# Altium project Terra.PrjPcb (part 3 of 3)

## Sheet Power.SchDoc
size A3; Author: Швецов С.В.; Organization: PapuaSoft; SheetNumber: 6; SheetTotal: 8
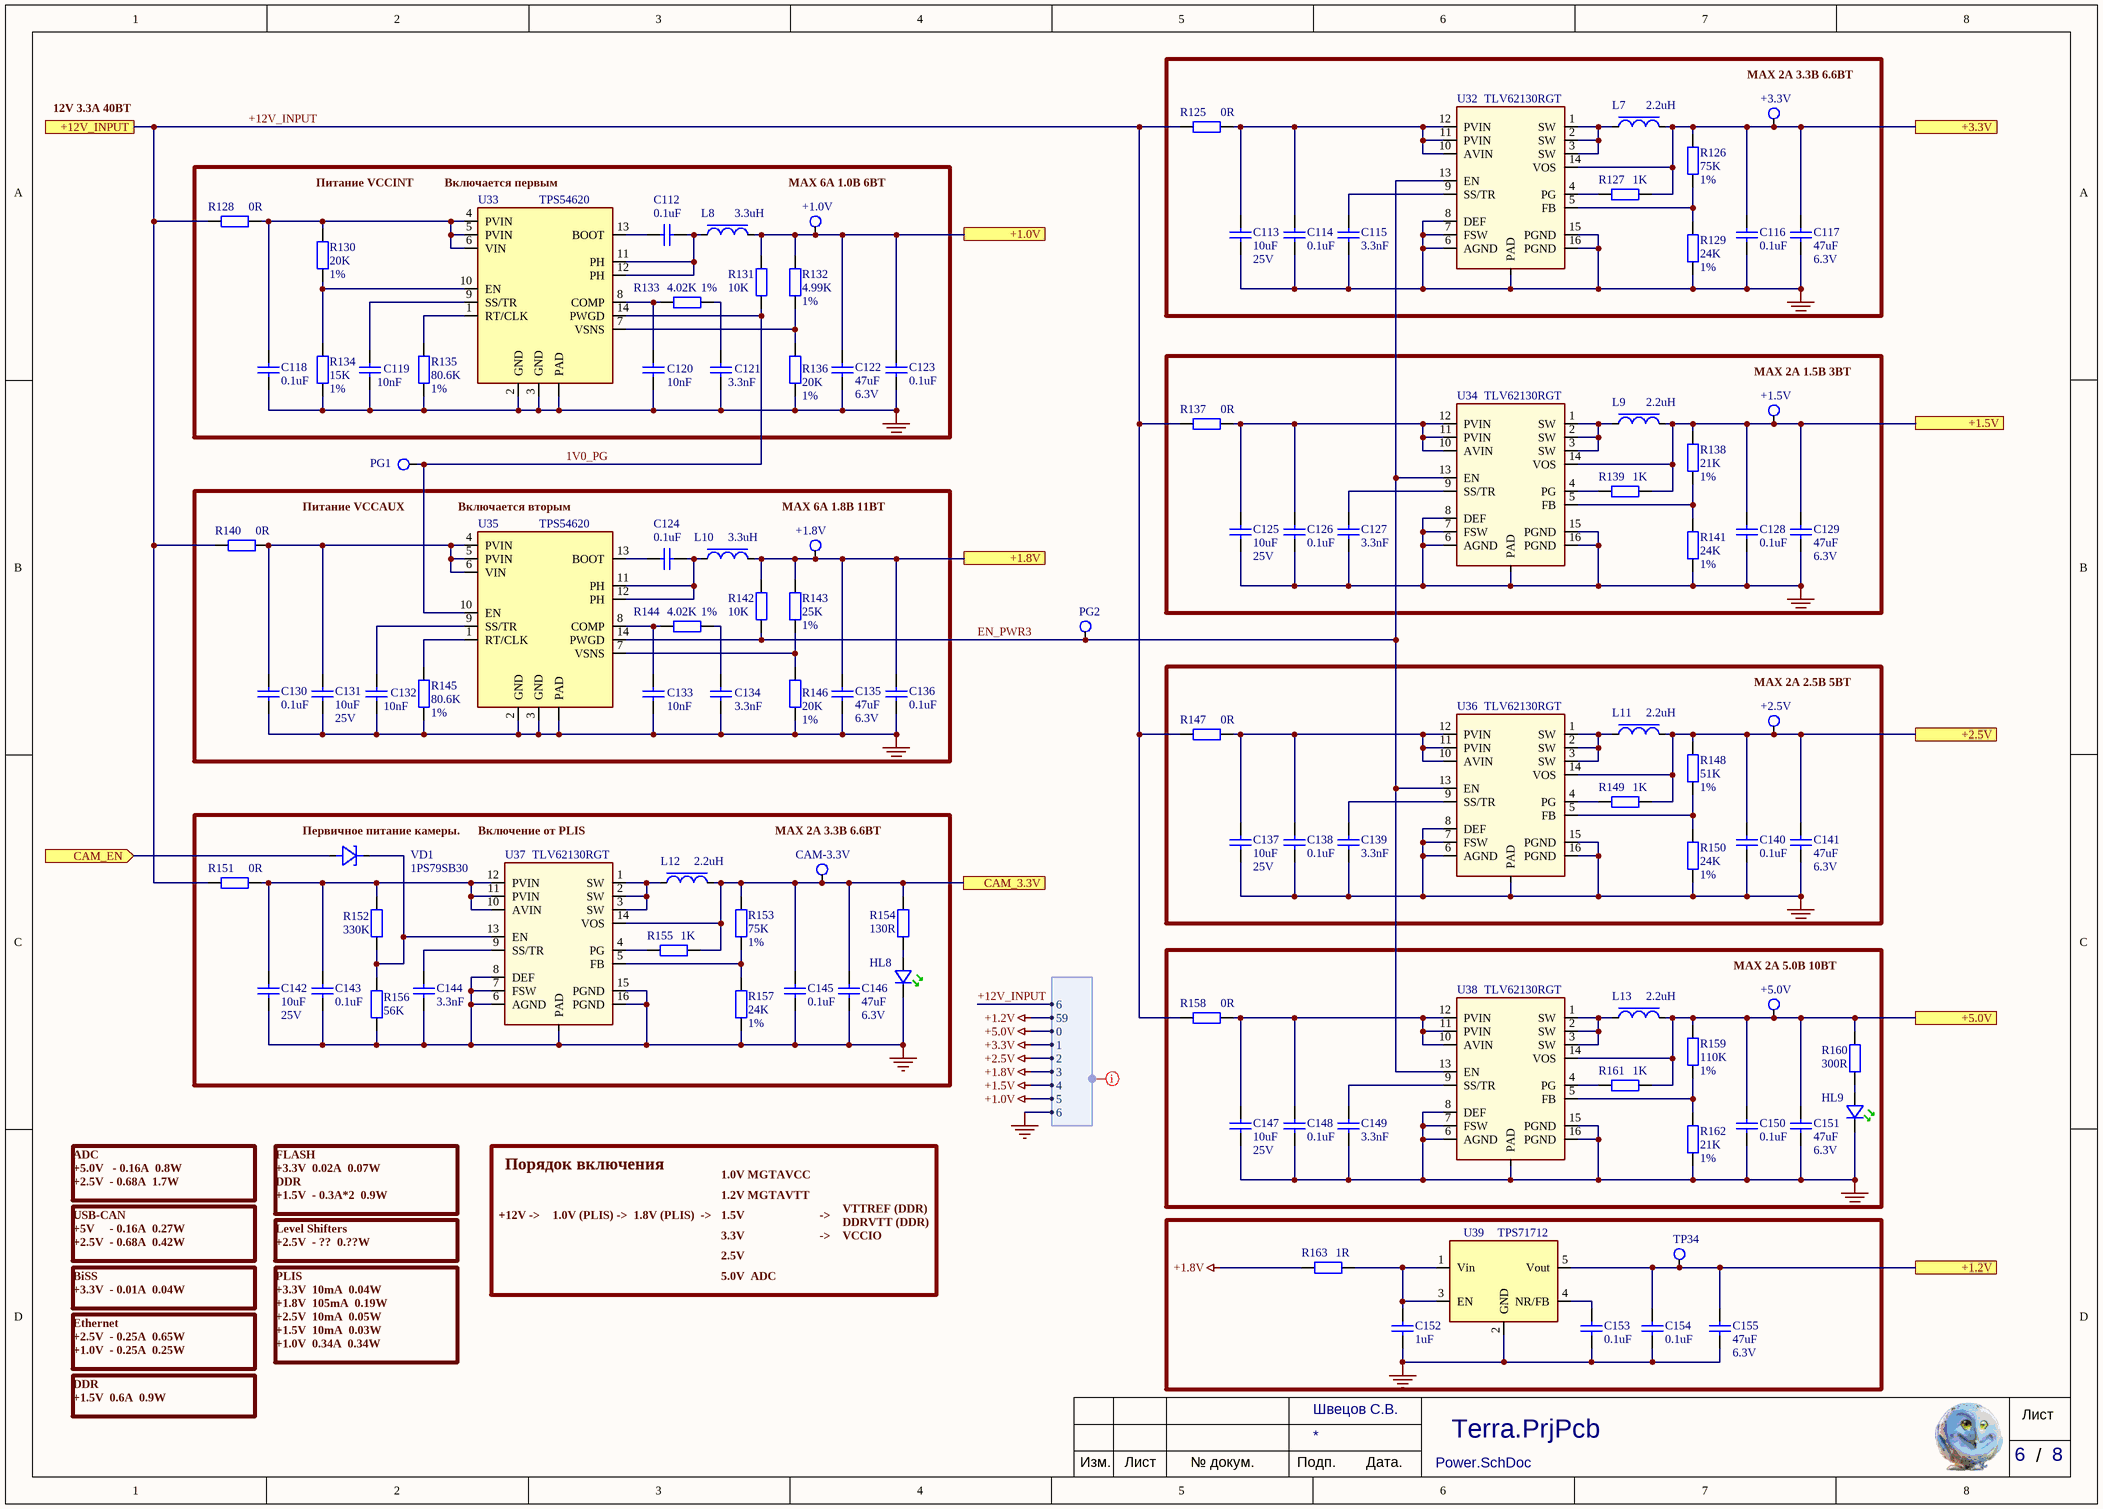
[diagram p8: Power.SchDoc]

### Parts
C112  value 0.1uF  [C0402]  (hidden comment: Cap)
C113  value 10uF  Voltage: 25V  [C0805]  (hidden comment: Cap)
C114  value 0.1uF  [C0402]  (hidden comment: Cap)
C115  value 3.3nF  [C0402]  (hidden comment: Cap)
C116  value 0.1uF  [C0402]  (hidden comment: Cap)
C117  value 47uF  Voltage: 6.3V  [C0805]  (hidden comment: Cap)
C118  value 0.1uF  [C0402]  (hidden comment: Cap)
C119  value 10nF  [C0402]  (hidden comment: Cap)
C120  value 10nF  [C0402]  (hidden comment: Cap)
C121  value 3.3nF  [C0402]  (hidden comment: Cap)
C122  value 47uF  Voltage: 6.3V  [C0805]  (hidden comment: Cap)
C123  value 0.1uF  [C0402]  (hidden comment: Cap)
C124  value 0.1uF  [C0402]  (hidden comment: Cap)
C125  value 10uF  Voltage: 25V  [C0805]  (hidden comment: Cap)
C126  value 0.1uF  [C0402]  (hidden comment: Cap)
C127  value 3.3nF  [C0402]  (hidden comment: Cap)
C128  value 0.1uF  [C0402]  (hidden comment: Cap)
C129  value 47uF  Voltage: 6.3V  [C0805]  (hidden comment: Cap)
C130  value 0.1uF  [C0402]  (hidden comment: Cap)
C131  value 10uF  Voltage: 25V  [C0805]  (hidden comment: Cap)
C132  value 10nF  [C0402]  (hidden comment: Cap)
C133  value 10nF  [C0402]  (hidden comment: Cap)
C134  value 3.3nF  [C0402]  (hidden comment: Cap)
C135  value 47uF  Voltage: 6.3V  [C0805]  (hidden comment: Cap)
C136  value 0.1uF  [C0402]  (hidden comment: Cap)
C137  value 10uF  Voltage: 25V  [C0805]  (hidden comment: Cap)
C138  value 0.1uF  [C0402]  (hidden comment: Cap)
C139  value 3.3nF  [C0402]  (hidden comment: Cap)
C140  value 0.1uF  [C0402]  (hidden comment: Cap)
C141  value 47uF  Voltage: 6.3V  [C0805]  (hidden comment: Cap)
C142  value 10uF  Voltage: 25V  [C0805]  (hidden comment: Cap)
C143  value 0.1uF  [C0402]  (hidden comment: Cap)
C144  value 3.3nF  [C0402]  (hidden comment: Cap)
C145  value 0.1uF  [C0402]  (hidden comment: Cap)
C146  value 47uF  Voltage: 6.3V  [C0805]  (hidden comment: Cap)
C147  value 10uF  Voltage: 25V  [C0805]  (hidden comment: Cap)
C148  value 0.1uF  [C0402]  (hidden comment: Cap)
C149  value 3.3nF  [C0402]  (hidden comment: Cap)
C150  value 0.1uF  [C0402]  (hidden comment: Cap)
C151  value 47uF  Voltage: 6.3V  [C0805]  (hidden comment: Cap)
C152  value 1uF  [C0603]  (hidden comment: Cap)
C153  value 0.1uF  [C0402]  (hidden comment: Cap)
C154  value 0.1uF  [C0402]  (hidden comment: Cap)
C155  value 47uF  Voltage: 6.3V  [C0805]  (hidden comment: Cap)
HL8  (no value)  [KP-1608_16x08x11_L]
HL9  (no value)  [KP-1608_16x08x11_L]
L7  2.2uH  [B82472G6222M000]
L8  3.3uH  [INDPM101101X680N]
L9  2.2uH  [B82472G6222M000]
L10  3.3uH  [INDPM101101X680N]
L11  2.2uH  [B82472G6222M000]
L12  2.2uH  [B82472G6222M000]
L13  2.2uH  [B82472G6222M000]
R125  value 0R  [R0402]  (hidden comment: Res2)
R126  value 75K  Precision: 1%  [R0402]  (hidden comment: Res2)
R127  value 1K  [R0402]  (hidden comment: Res2)
R128  value 0R  [R0402]  (hidden comment: Res2)
R129  value 24K  Precision: 1%  [R0402]  (hidden comment: Res2)
R130  value 20K  Precision: 1%  [R0402]  (hidden comment: Res2)
R131  value 10K  [R0402]  (hidden comment: Res2)
R132  value 4.99K  Precision: 1%  [R0402]  (hidden comment: Res2)
R133  value 4.02K  Precision: 1%  [R0402]  (hidden comment: Res2)
R134  value 15K  Precision: 1%  [R0402]  (hidden comment: Res2)
R135  value 80.6K  Precision: 1%  [R0402]  (hidden comment: Res2)
R136  value 20K  Precision: 1%  [R0402]  (hidden comment: Res2)
R137  value 0R  [R0402]  (hidden comment: Res2)
R138  value 21K  Precision: 1%  [R0402]  (hidden comment: Res2)
R139  value 1K  [R0402]  (hidden comment: Res2)
R140  value 0R  [R0402]  (hidden comment: Res2)
R141  value 24K  Precision: 1%  [R0402]  (hidden comment: Res2)
R142  value 10K  [R0402]  (hidden comment: Res2)
R143  value 25K  Precision: 1%  [R0402]  (hidden comment: Res2)
R144  value 4.02K  Precision: 1%  [R0402]  (hidden comment: Res2)
R145  value 80.6K  Precision: 1%  [R0402]  (hidden comment: Res2)
R146  value 20K  Precision: 1%  [R0402]  (hidden comment: Res2)
R147  value 0R  [R0402]  (hidden comment: Res2)
R148  value 51K  Precision: 1%  [R0402]  (hidden comment: Res2)
R149  value 1K  [R0402]  (hidden comment: Res2)
R150  value 24K  Precision: 1%  [R0402]  (hidden comment: Res2)
R151  value 0R  [R0402]  (hidden comment: Res2)
R152  value 330K  [R0402]  (hidden comment: Res2)
R153  value 75K  Precision: 1%  [R0402]  (hidden comment: Res2)
R154  value 130R  [R0402]  (hidden comment: Res2)
R155  value 1K  [R0402]  (hidden comment: Res2)
R156  value 56K  [R0402]  (hidden comment: Res2)
R157  value 24K  Precision: 1%  [R0402]  (hidden comment: Res2)
R158  value 0R  [R0402]  (hidden comment: Res2)
R159  value 110K  Precision: 1%  [R0402]  (hidden comment: Res2)
R160  value 300R  [R0402]  (hidden comment: Res2)
R161  value 1K  [R0402]  (hidden comment: Res2)
R162  value 21K  Precision: 1%  [R0402]  (hidden comment: Res2)
R163  value 1R  [R0402]  (hidden comment: Res2)
TP25  MarkPCB: +3.3V  [TP_0MM5_1MM0]  (no BOM)
TP26  MarkPCB: +1.0V  [TP_0MM5_1MM0]  (no BOM)
TP27  MarkPCB: +1.5V  [TP_0MM5_1MM0]  (no BOM)
TP28  MarkPCB: PG1  [TP_0MM5_1MM0]  (no BOM)
TP29  MarkPCB: +1.8V  [TP_0MM5_1MM0]  (no BOM)
TP30  MarkPCB: PG2  [TP_0MM5_1MM0]  (no BOM)
TP31  MarkPCB: +2.5V  [TP_0MM5_1MM0]  (no BOM)
TP32  MarkPCB: CAM-3.3V  [TP_0MM5_1MM0]  (no BOM)
TP33  MarkPCB: +5.0V  [TP_0MM5_1MM0]  (no BOM)
TP34  (no value)  [TP_0MM5_1MM0]  (no BOM)
U32  TLV62130RGT  [QFN50P300X300X100-17N-D]
U33  value TPS54620  [RGY-(S-PVQFN-N14)]  (hidden comment: TPS60500)
U34  TLV62130RGT  [QFN50P300X300X100-17N-D]
U35  value TPS54620  [RGY-(S-PVQFN-N14)]  (hidden comment: TPS60500)
U36  TLV62130RGT  [QFN50P300X300X100-17N-D]
U37  TLV62130RGT  [QFN50P300X300X100-17N-D]
U38  TLV62130RGT  [QFN50P300X300X100-17N-D]
U39  value TPS71712  [SOT23_5]
VD1  1PS79SB30  [sod523]

### Ports
+1.0V, +1.2V, +1.5V, +1.8V, +2.5V, +3.3V, +5.0V, +12V_INPUT, CAM_3.3V, CAM_EN (in)

### Harnesses
POWER: 0, 1, 2, 3, 4, 5, 6, 59, 6

### Nets
+1.0V: C122.1 C123.1 L8.1 R131.2 R132.2 TP26.1(e1) ; port +1.0V, harness POWER.5
+1.2V: C154.1 C155.1 TP34.1(e1) U39.5(Vout) ; port +1.2V, harness POWER.59
+1.5V: C128.1 C129.1 L9.1 R138.1 R139.1 TP27.1(e1) U34.14(VOS) ; port +1.5V, harness POWER.4
+1.8V: C135.1 C136.1 L10.1 R142.2 R143.2 R163.2 TP29.1(e1) ; port +1.8V, harness POWER.3
+2.5V: C140.1 C141.1 L11.1 R148.1 R149.1 TP31.1(e1) U36.14(VOS) ; port +2.5V, harness POWER.2
+3.3V: C116.1 C117.1 L7.1 R126.1 R127.1 TP25.1(e1) U32.14(VOS) ; port +3.3V, harness POWER.1
+5.0V: C150.1 C151.1 L13.1 R159.1 R160.2 R161.1 TP33.1(e1) U38.14(VOS) ; port +5.0V, harness POWER.0
+12V_INPUT: C113.2 C114.2 C115.2 C116.2 C117.2 C118.2 C119.1 C120.1 C121.1 C122.2 C123.2 C125.2 C126.2 C127.2 C128.2 C129.2 C130.2 C131.2 C132.1 C133.1 C134.1 C135.2 C136.2 C137.2 C138.2 C139.2 C140.2 C141.2 C142.2 C143.2 C144.2 C145.2 C146.2 C147.2 C148.2 C149.2 C150.2 C151.2 C152.2 C153.2 C154.2 C155.2 HL8.2(Cathode) HL9.2(Cathode) R125.2 R128.2 R129.1 R134.2 R135.1 R136.1 R137.2 R140.2 R141.1 R145.1 R146.1 R147.2 R150.1 R151.2 R156.1 R157.1 R158.2 R162.1 U32.0(PAD) U32.6(AGND) U32.7(FSW) U32.8(DEF) U32.15(PGND) U32.16(PGND) U33.0(PAD) U33.2(GND) U33.3(GND) U34.0(PAD) U34.6(AGND) U34.7(FSW) U34.8(DEF) U34.15(PGND) U34.16(PGND) U35.0(PAD) U35.2(GND) U35.3(GND) U36.0(PAD) U36.6(AGND) U36.7(FSW) U36.8(DEF) U36.15(PGND) U36.16(PGND) U37.0(PAD) U37.6(AGND) U37.7(FSW) U37.8(DEF) U37.15(PGND) U37.16(PGND) U38.0(PAD) U38.6(AGND) U38.7(FSW) U38.8(DEF) U38.15(PGND) U38.16(PGND) U39.2(GND) ; port +12V_INPUT, harness POWER.6  [also labelled GND]
1V0_PG: R131.1 TP28.1(e1) U33.14(PWGD) U35.10(EN)
CAM_EN: VD1.2 ; port CAM_EN
EN_PWR3: R142.1 TP30.1(e1) U32.13(EN) U34.13(EN) U35.14(PWGD) U36.13(EN) U38.13(EN)
NetC61_1: C145.1 C146.1 L12.1 R153.1 R154.2 R155.1 TP32.1(e1) U37.14(VOS) ; port CAM_3.3V
NetC112_1: C112.1 U33.13(BOOT)
NetC112_2: C112.2 L8.2 U33.11(PH) U33.12(PH)
NetC113_1: C113.1 C114.1 R125.1 U32.10(AVIN) U32.11(PVIN) U32.12(PVIN)
NetC115_1: C115.1 U32.9(SS/TR)
NetC118_1: C118.1 R128.1 R130.1 U33.4(PVIN) U33.5(PVIN) U33.6(VIN)
NetC119_2: C119.2 U33.9(SS/TR)
NetC120_2: C120.2 R133.1 U33.8(COMP)
NetC121_2: C121.2 R133.2
NetC124_1: C124.1 U35.13(BOOT)
NetC124_2: C124.2 L10.2 U35.11(PH) U35.12(PH)
NetC125_1: C125.1 C126.1 R137.1 U34.10(AVIN) U34.11(PVIN) U34.12(PVIN)
NetC127_1: C127.1 U34.9(SS/TR)
NetC130_1: C130.1 C131.1 R140.1 U35.4(PVIN) U35.5(PVIN) U35.6(VIN)
NetC132_2: C132.2 U35.9(SS/TR)
NetC133_2: C133.2 R144.1 U35.8(COMP)
NetC134_2: C134.2 R144.2
NetC137_1: C137.1 C138.1 R147.1 U36.10(AVIN) U36.11(PVIN) U36.12(PVIN)
NetC139_1: C139.1 U36.9(SS/TR)
NetC142_1: C142.1 C143.1 R151.1 R152.2 U37.10(AVIN) U37.11(PVIN) U37.12(PVIN)
NetC144_1: C144.1 U37.9(SS/TR)
NetC147_1: C147.1 C148.1 R158.1 U38.10(AVIN) U38.11(PVIN) U38.12(PVIN)
NetC149_1: C149.1 U38.9(SS/TR)
NetC152_1: C152.1 R163.1 U39.1(Vin) U39.3(EN)
NetC153_1: C153.1 U39.4(NR/FB)
NetHL8_1: HL8.1(Anode) R154.1
NetHL9_1: HL9.1(Anode) R160.1
NetL7_2: L7.2 U32.1(SW) U32.2(SW) U32.3(SW)
NetL9_2: L9.2 U34.1(SW) U34.2(SW) U34.3(SW)
NetL11_2: L11.2 U36.1(SW) U36.2(SW) U36.3(SW)
NetL12_2: L12.2 U37.1(SW) U37.2(SW) U37.3(SW)
NetL13_2: L13.2 U38.1(SW) U38.2(SW) U38.3(SW)
NetR126_2: R126.2 R129.2 U32.5(FB)
NetR127_2: R127.2 U32.4(PG)
NetR130_2: R130.2 R134.1 U33.10(EN)
NetR132_1: R132.1 R136.2 U33.7(VSNS)
NetR135_2: R135.2 U33.1(RT/CLK)
NetR138_2: R138.2 R141.2 U34.5(FB)
NetR139_2: R139.2 U34.4(PG)
NetR143_1: R143.1 R146.2 U35.7(VSNS)
NetR145_2: R145.2 U35.1(RT/CLK)
NetR148_2: R148.2 R150.2 U36.5(FB)
NetR149_2: R149.2 U36.4(PG)
NetR152_1: R152.1 R156.2 U37.13(EN) VD1.1
NetR153_2: R153.2 R157.2 U37.5(FB)
NetR155_2: R155.2 U37.4(PG)
NetR159_2: R159.2 R162.2 U38.5(FB)
NetR161_2: R161.2 U38.4(PG)

### Layout directives
net class POWER: (no net found under the mark)

### Notes on the sheet
- 12V 3.3A 40ВТ
- (near TP25) MAX 2A 3.3В 6.6ВТ
- (near U33) Включается первым
- MAX 6A 1.0В 6ВТ
- Питание VCCINT
- (near TP27) MAX 2A 1.5В 3ВТ
- (near TP28) Питание VCCAUX
- (near U35) Включается вторым
- MAX 6A 1.8В 11ВТ
- (near TP31) MAX 2A 2.5В 5ВТ
- (near VD1) Первичное питание камеры.
- (near U37) Включение от PLIS
- (near TP32) MAX 2A 3.3В 6.6ВТ
- (near TP33) MAX 2A 5.0В 10ВТ
- Порядок включения
- 1.0V MGTAVCC
- USB-CAN
  +5V     - 0.16A  0.27W
  +2.5V  - 0.68A  0.42W
- ADC
  +5.0V   - 0.16A  0.8W
  +2.5V  - 0.68A  1.7W
- FLASH
  +3.3V  0.02A  0.07W
  DDR
  +1.5V  - 0.3A*2  0.9W
- Level Shifters
  +2.5V  - ??  0.??W
- +12V ->
- 1.0V (PLIS) ->
- 1.8V (PLIS)  ->
- 1.5V                         ->
- 3.3V                         ->
- 1.2V MGTAVTT
- 2.5V
- VCCIO ->
- DDRVTT (DDR)
- VTTREF (DDR)
- BiSS
  +3.3V  - 0.01A  0.04W
- 5.0V  ADC
- Ethernet
  +2.5V  - 0.25A  0.65W
  +1.0V  - 0.25A  0.25W
- PLIS
  +3.3V  10mA  0.04W
  +1.8V  105mA  0.19W
  +2.5V  10mA  0.05W
  +1.5V  10mA  0.03W
  +1.0V  0.34A  0.34W
- DDR
  +1.5V  0.6A  0.9W
- Лист
- /
- Изм.
- № докум.
- Подп.
- Дата.

### Library data of the parts
C112 C114-C116 C118-C121 C123 C124 C126-C128 C130 C132-C134 C136 C138-C140 C143-C145 C148-C150 C153 C154 = Cap: Конденсатор керамический; Voltage: 25V; PackageReference: 0402
  C112 C118-C121 C123: ClassName: Power1.0
  C114-C116: ClassName: Power3.3
  C124 C130 C132-C134 C136: ClassName: Power1.8
  C126-C128: ClassName: Power1.5
  C138-C140: ClassName: Power2.5
  C143-C145: ClassName: Power33cam
  C148-C150: ClassName: Power5.0
C113 C125 C131 C137 C142 C147 = Cap: GRM21BR61E106KA73L; PackageReference: 0805
  C113: ClassName: Power3.3
  C125: ClassName: Power1.5
  C137: ClassName: Power2.5
  C142: ClassName: Power33cam
  C147: ClassName: Power5.0
C117 C122 C129 C135 C141 C146 C151 C155 = Cap: C0805C476M9PAC; PackageReference: 0805
  C117: ClassName: Power3.3
  C122: ClassName: Power1.0
  C129: ClassName: Power1.5
  C135: ClassName: Power1.8
  C141: ClassName: Power2.5
  C146: ClassName: Power33cam
  C151: ClassName: Power5.0
C152 = Cap: Конденсатор керамический; PackageReference: 0603
HL8 HL9 = ledG_KP-1608MGC_KP-1608: as HL10 on sheet Xilinx_DDR; Value: KP-1608MGC; PackageReference: 0603; Package: KP-1608_16x08x11
L7 L9 L11-L13 = LPS4012: 2.2uH, 3.4A, 0.047R; Value: B82472G6222M000
  L7: ClassName: Power3.3
  L9: ClassName: Power1.5
  L11: ClassName: Power2.5
  L12: ClassName: Power33cam
  L13: ClassName: Power5.0
L8 L10 = LPS4012: 3.3uH, 6.4A, 12.5mΩ; Value: SLF10165T-3R3N5R83PF
  L8: ClassName: Power1.0
  L10: ClassName: Power1.8
R125-R163 = Res2: Резистор; PackageReference: 0402
  R125-R127 R129: ClassName: Power3.3
  R128 R131-R133 R135 R136: ClassName: Power1.0
  R137-R139 R141: ClassName: Power1.5
  R140 R142-R146: ClassName: Power1.8
  R147-R150: ClassName: Power2.5
  R151-R153 R155-R157: ClassName: Power33cam
  R158 R159 R161 R162: ClassName: Power5.0
TP25-TP33 = Test_Point: Тестовая точка на плате
  TP25: ClassName: Power3.3
  TP26 TP28: ClassName: Power1.0
  TP27: ClassName: Power1.5
  TP29 TP30: ClassName: Power1.8
  TP31: ClassName: Power2.5
  TP32: ClassName: Power33cam
  TP33: ClassName: Power5.0
TP34 = Test_Point: Тестовая точка на плате; MarkPCB: +1.2V
U32 U34 U36-U38 = TLV62130RGT: 3V to 17V 3A Step-Down Converter; PackageReference: VQFN-16; Value: TLV62130RGT
  U32: ClassName: Power3.3
  U34: ClassName: Power1.5
  U36: ClassName: Power2.5
  U37: ClassName: Power33cam
  U38: ClassName: Power5.0
U33 U35 = TPS54620: 4.5V to 17V  6A Step-down Converter; PackageReference: VQFN-14
  U33: ClassName: Power1.0
  U35: ClassName: Power1.8
U39 = TPS71701: Линейный стабилизатор +1.2В; PackageReference: SC70-5; Parameter 1: *
VD1 = MSS1P3L: Диод Шоттки 40В 0.2А; Value: 1PS79SB30,115; PackageReference: SOD523

## Sheet Ethernet.SchDoc
size A3; Author: Швецов С.В.; Organization: PapuaSoft; SheetNumber: 8; SheetTotal: 8
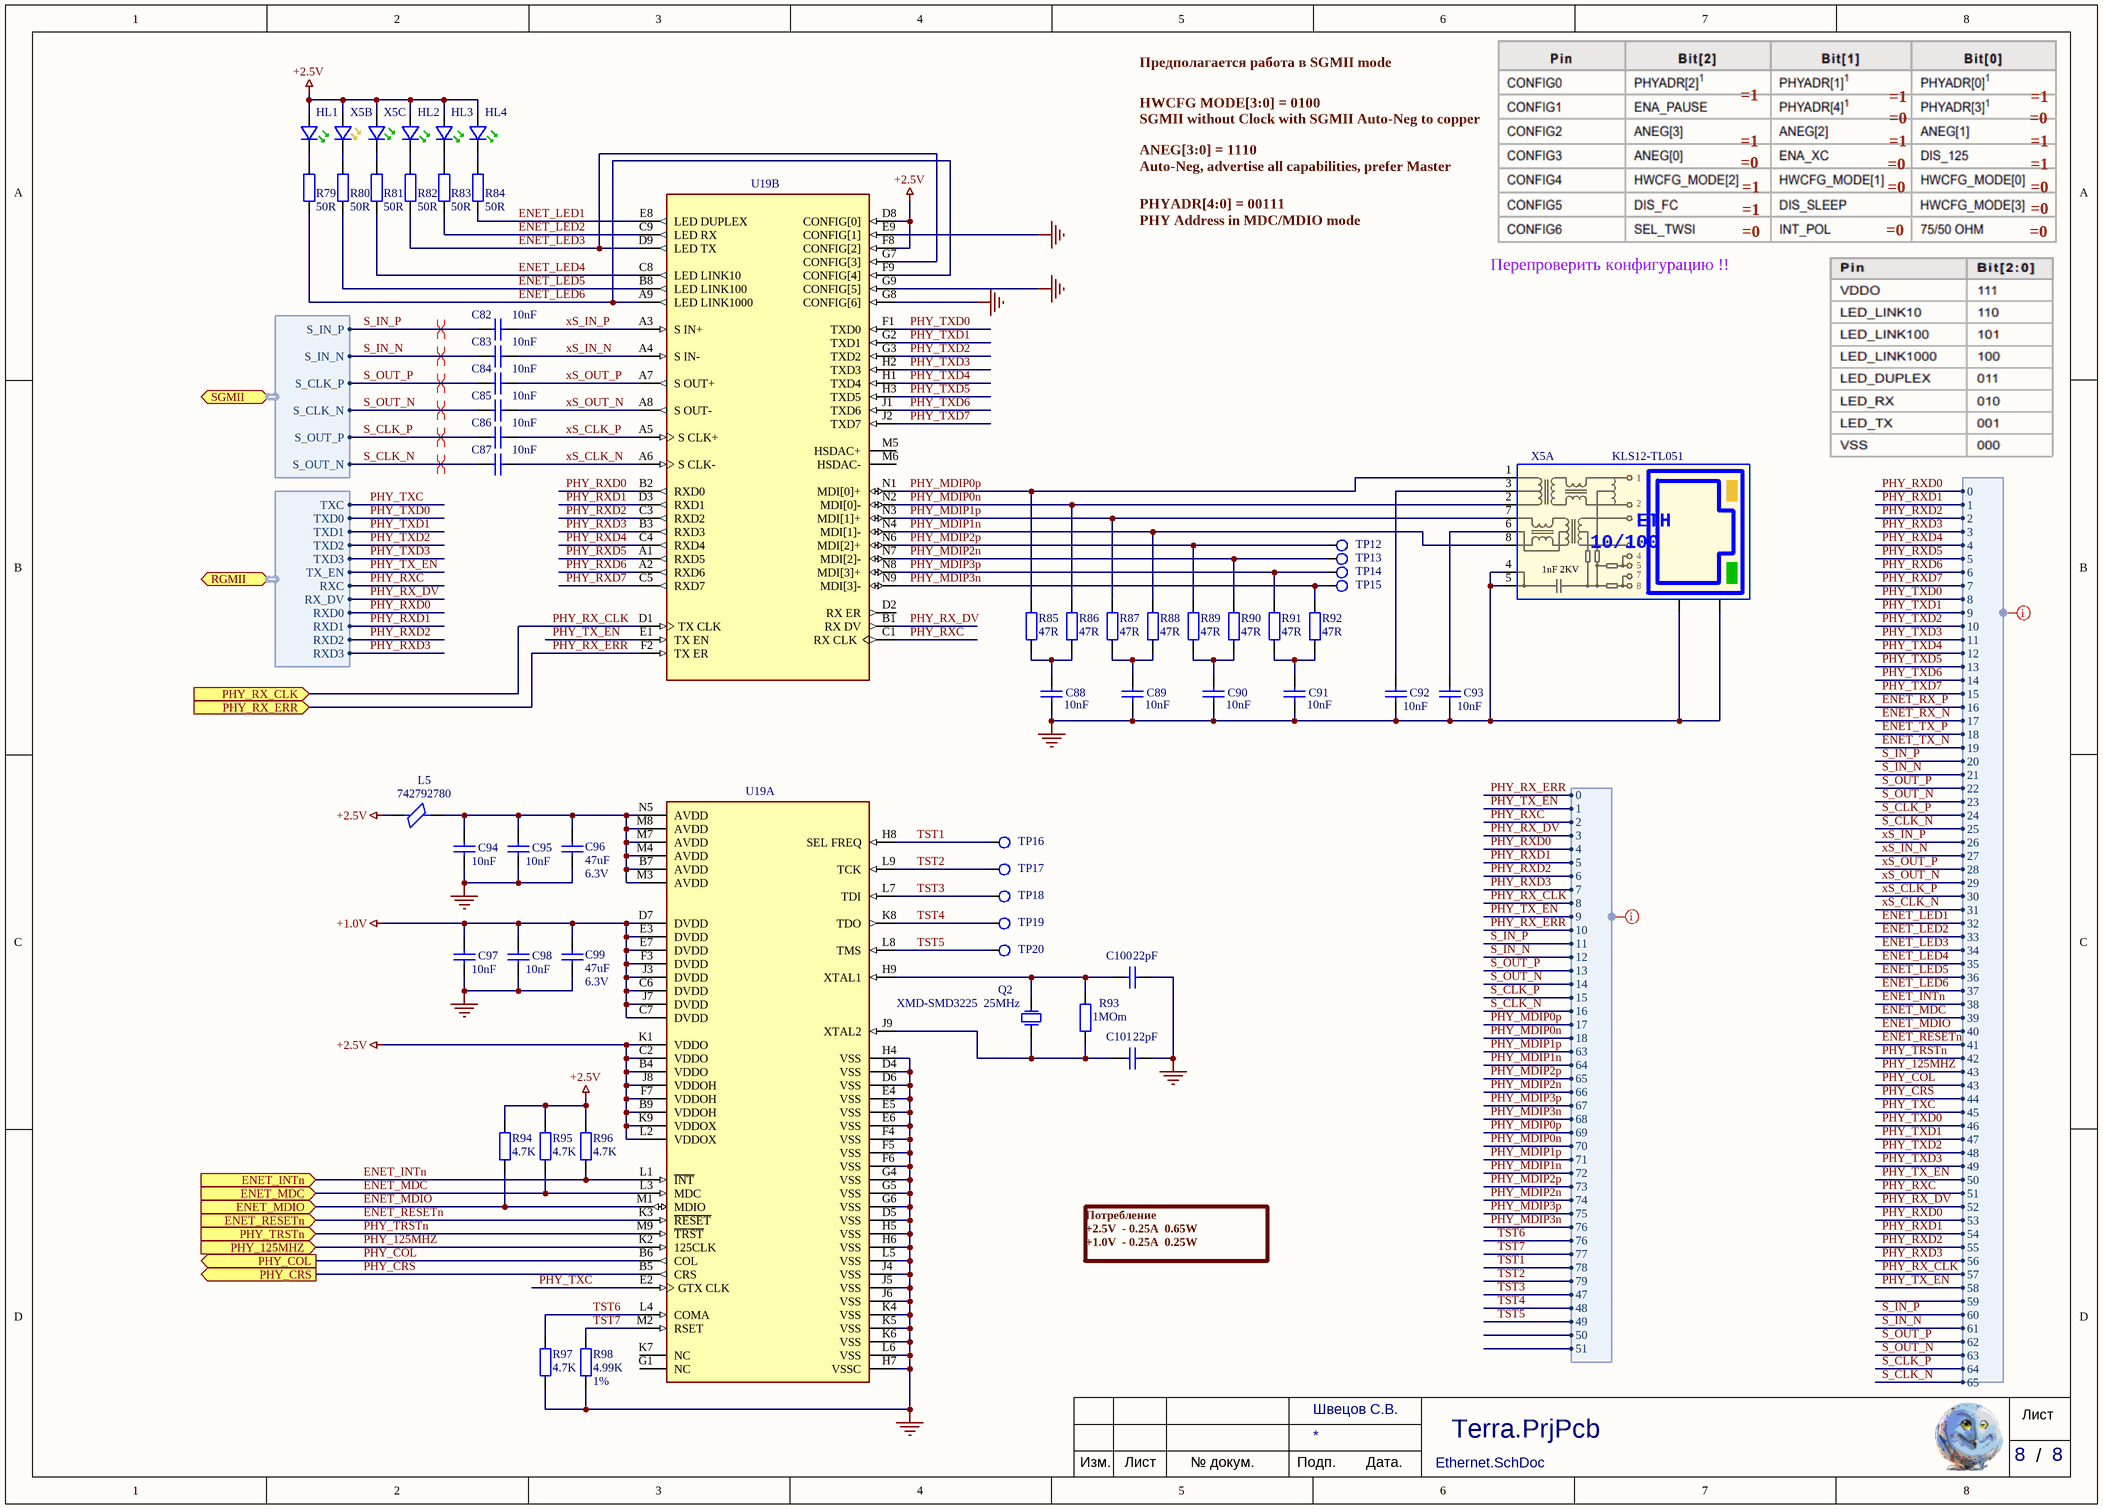
[diagram p9: Ethernet.SchDoc]

### Parts
C82  value 10nF  [C0402]  (hidden comment: Cap)
C83  value 10nF  [C0402]  (hidden comment: Cap)
C84  value 10nF  [C0402]  (hidden comment: Cap)
C85  value 10nF  [C0402]  (hidden comment: Cap)
C86  value 10nF  [C0402]  (hidden comment: Cap)
C87  value 10nF  [C0402]  (hidden comment: Cap)
C88  value 10nF  [C0402]  (hidden comment: Cap)
C89  value 10nF  [C0402]  (hidden comment: Cap)
C90  value 10nF  [C0402]  (hidden comment: Cap)
C91  value 10nF  [C0402]  (hidden comment: Cap)
C92  value 10nF  [C0402]  (hidden comment: Cap)
C93  value 10nF  [C0402]  (hidden comment: Cap)
C94  value 10nF  [C0402]  (hidden comment: Cap)
C95  value 10nF  [C0402]  (hidden comment: Cap)
C96  value 47uF  Voltage: 6.3V  [C0805]  (hidden comment: Cap)
C97  value 10nF  [C0402]  (hidden comment: Cap)
C98  value 10nF  [C0402]  (hidden comment: Cap)
C99  value 47uF  Voltage: 6.3V  [C0805]  (hidden comment: Cap)
C100  value 22pF  [C0402]  (hidden comment: Cap)
C101  value 22pF  [C0402]  (hidden comment: Cap)
HL1  (no value)  [KP-1608_16x08x11_L]
HL2  (no value)  [KP-1608_16x08x11_L]
HL3  (no value)  [KP-1608_16x08x11_L]
HL4  (no value)  [KP-1608_16x08x11_L]
L5  742792780  [L0402]
Q2  XMD-SMD3225  25MHz  [KX-5T]
R79  value 50R  [R0402]  (hidden comment: Res2)
R80  value 50R  [R0402]  (hidden comment: Res2)
R81  value 50R  [R0402]  (hidden comment: Res2)
R82  value 50R  [R0402]  (hidden comment: Res2)
R83  value 50R  [R0402]  (hidden comment: Res2)
R84  value 50R  [R0402]  (hidden comment: Res2)
R85  value 47R  [R0402]  (hidden comment: Res2)
R86  value 47R  [R0402]  (hidden comment: Res2)
R87  value 47R  [R0402]  (hidden comment: Res2)
R88  value 47R  [R0402]  (hidden comment: Res2)
R89  value 47R  [R0402]  (hidden comment: Res2)
R90  value 47R  [R0402]  (hidden comment: Res2)
R91  value 47R  [R0402]  (hidden comment: Res2)
R92  value 47R  [R0402]  (hidden comment: Res2)
R93  value 1MOm  [R0402]  (hidden comment: Res2)
R94  value 4.7K  [R0402]  (hidden comment: Res2)
R95  value 4.7K  [R0402]  (hidden comment: Res2)
R96  value 4.7K  [R0402]  (hidden comment: Res2)
R97  value 4.7K  [R0402]  (hidden comment: Res2)
R98  value 4.99K  Precision: 1%  [R0402]  (hidden comment: Res2)
TP12  (no value)  [TP_0MM5_1MM0]  (no BOM)
TP13  (no value)  [TP_0MM5_1MM0]  (no BOM)
TP14  (no value)  [TP_0MM5_1MM0]  (no BOM)
TP15  (no value)  [TP_0MM5_1MM0]  (no BOM)
TP16  (no value)  [TP_0MM5_1MM0]  (no BOM)
TP17  (no value)  [TP_0MM5_1MM0]  (no BOM)
TP18  (no value)  [TP_0MM5_1MM0]  (no BOM)
TP19  (no value)  [TP_0MM5_1MM0]  (no BOM)
TP20  (no value)  [TP_0MM5_1MM0]  (no BOM)
U19  88E1111-B2-BAB1C000  [Marvell_88E1111-B2-BAB1C000_0]  (value not drawn)  (parts A,B of 2)
X5  KLS12-TL051  [KLS12-TL051]  (parts A,B,C of 3)

### Ports
ENET_INTn (in), ENET_MDC (in), ENET_MDIO (in), ENET_RESETn (in), PHY_125MHZ (in), PHY_COL (out), PHY_CRS (out), PHY_RX_CLK (in), PHY_RX_ERR (in), PHY_TRSTn (in), RGMII (bidir, harness RGMII), SGMII (bidir, harness SGMII)

### Harnesses
Ethernet: 0, 1, 2, 3, 4, 5, 6, 7, 8, 9, 11, 12, 10, 13, 14, 15, 16, 17, 18, 19, 20, 21, 22, 23, 24, 25, 26, 27, 28, 29, 30, 31, 32, 33, 34, 35, 36, 37, 38, 39, 40, 41, 42, 43, 43, 44, 45, 46, 47, 48, 49, 50, 51, 52, 53, 54, 55, 56, 57, 58, 59, 60, 61, 62, 63, 64, 65
SGMII: S_IN_P, S_IN_N, S_CLK_P, S_CLK_N, S_OUT_P, S_OUT_N
RGMII: TXC, TXD0, TXD1, TXD2, TXD3, TX_EN, RXC, RX_DV, RXD0, RXD1, RXD2, RXD3
Ethernet2: 0, 1, 2, 3, 4, 5, 6, 7, 8, 9, 10, 12, 13, 14, 11, 15, 16, 17, 18, 63, 64, 65, 66, 67, 68, 69, 70, 71, 72, 73, 74, 75, 76, 76, 77, 78, 79, 47, 48, 49, 50, 51

### Nets
+1.0V: C97.1 C98.1 C99.1 U19.C6(DVDD) U19.C7(DVDD) U19.D7(DVDD) U19.E3(DVDD) U19.E7(DVDD) U19.F3(DVDD) U19.J3(DVDD) U19.J7(DVDD)
+2.5V: HL1.1(Anode) HL2.1(Anode) HL3.1(Anode) HL4.1(Anode) L5.1 R94.1 R95.1 R96.1 U19.B4(VDDO) U19.B9(VDDOH) U19.C2(VDDO) U19.D8(CONFIG[0]) U19.F7(VDDOH) U19.F8(CONFIG[2]) U19.J8(VDDOH) U19.K1(VDDO) U19.K9(VDDOX) U19.L2(VDDOX) X5.9 X5.12
GND: C88.2 C89.2 C90.2 C91.2 C92.2 C93.2 C94.2 C95.2 C96.2 C97.2 C98.2 C99.2 C100.2 C101.2 R97.2 R98.1 U19.D4(VSS) U19.D5(VSS) U19.D6(VSS) U19.E4(VSS) U19.E5(VSS) U19.E6(VSS) U19.E9(CONFIG[1]) U19.F4(VSS) U19.F5(VSS) U19.F6(VSS) U19.G4(VSS) U19.G5(VSS) U19.G6(VSS) U19.G8(CONFIG[6]) U19.G9(CONFIG[5]) U19.H4(VSS) U19.H5(VSS) U19.H6(VSS) U19.H7(VSSC) U19.J4(VSS) U19.J5(VSS) U19.J6(VSS) U19.K4(VSS) U19.K5(VSS) U19.K6(VSS) U19.L5(VSS) U19.L6(VSS) X5.0(PAD1) X5.4 X5.5  [project net +12V_INPUT]
ENET_INTn: R96.2 U19.L1(~{INT}) ; port ENET_INTn, harness Ethernet.38
ENET_LED1: R84.1 U19.E8(LED_DUPLEX) ; harness Ethernet.32
ENET_LED2: R83.1 U19.C9(LED_RX) ; harness Ethernet.33
ENET_LED3: R82.1 U19.D9(LED_TX) U19.G7(CONFIG[3]) ; harness Ethernet.34
ENET_LED4: R81.1 U19.C8(LED_LINK10) ; harness Ethernet.35
ENET_LED5: R80.1 U19.B8(LED_LINK100) ; harness Ethernet.36
ENET_LED6: R79.1 U19.A9(LED_LINK1000) U19.F9(CONFIG[4]) ; harness Ethernet.37
ENET_MDC: R95.2 U19.L3(MDC) ; port ENET_MDC, harness Ethernet.39
ENET_MDIO: R94.2 U19.M1(MDIO) ; port ENET_MDIO, harness Ethernet.40
ENET_RESETn: U19.K3(~{RESET}) ; port ENET_RESETn, harness Ethernet.41
ENET_RX_N: harness Ethernet.17
ENET_RX_P: harness Ethernet.16
ENET_TX_N: harness Ethernet.19
ENET_TX_P: harness Ethernet.18
PHY_125MHZ: U19.B6(COL) U19.K2(125CLK) ; port PHY_125MHZ, port PHY_COL, harness Ethernet.43  [also labelled PHY_COL]
PHY_CRS: U19.B5(CRS) ; port PHY_CRS, harness Ethernet.44
PHY_MDIP0n: R86.1 U19.N2(MDI[0]-) X5.2 ; harness Ethernet2.18, harness Ethernet2.70
PHY_MDIP0p: R85.1 U19.N1(MDI[0]+) X5.1 ; harness Ethernet2.17, harness Ethernet2.69
PHY_MDIP1n: R88.1 U19.N4(MDI[1]-) X5.8 ; harness Ethernet2.64, harness Ethernet2.72
PHY_MDIP1p: R87.1 U19.N3(MDI[1]+) X5.7 ; harness Ethernet2.63, harness Ethernet2.71
PHY_MDIP2n: R90.1 TP13.1(e1) U19.N7(MDI[2]-) ; harness Ethernet2.66, harness Ethernet2.74
PHY_MDIP2p: R89.1 TP12.1(e1) U19.N6(MDI[2]+) ; harness Ethernet2.65, harness Ethernet2.73
PHY_MDIP3n: R92.1 R97.1 TP15.1(e1) U19.L4(COMA) U19.N9(MDI[3]-) ; harness Ethernet2.68, harness Ethernet2.76  [also labelled TST6]
PHY_MDIP3p: R91.1 TP14.1(e1) U19.N8(MDI[3]+) ; harness Ethernet2.67, harness Ethernet2.75
PHY_RX_CLK: U19.D1(TX_CLK) ; port PHY_RX_CLK, harness Ethernet.57, harness Ethernet2.8
PHY_RX_DV: U19.B1(RX_DV) ; harness Ethernet.52, port RGMII.RX_DV, harness Ethernet2.3
PHY_RX_ERR: U19.F2(TX_ER) ; port PHY_RX_ERR, harness Ethernet2.0, harness Ethernet2.10
PHY_RXC: U19.C1(RX_CLK) ; harness Ethernet.51, port RGMII.RXC, harness Ethernet2.2
PHY_RXD0: U19.B2(RXD0) ; harness Ethernet.0, harness Ethernet.53, port RGMII.RXD0, harness Ethernet2.4
PHY_RXD1: U19.D3(RXD1) ; harness Ethernet.1, harness Ethernet.54, port RGMII.RXD1, harness Ethernet2.5
PHY_RXD2: U19.C3(RXD2) ; harness Ethernet.2, harness Ethernet.55, port RGMII.RXD2, harness Ethernet2.6
PHY_RXD3: U19.B3(RXD3) ; harness Ethernet.3, harness Ethernet.56, port RGMII.RXD3, harness Ethernet2.7
PHY_RXD4: U19.C4(RXD4) ; harness Ethernet.4
PHY_RXD5: U19.A1(RXD5) ; harness Ethernet.5
PHY_RXD6: U19.A2(RXD6) ; harness Ethernet.6
PHY_RXD7: U19.C5(RXD7) ; harness Ethernet.7
PHY_TRSTn: U19.M9(~{TRST}) ; port PHY_TRSTn, harness Ethernet.42
PHY_TX_EN: U19.E1(TX_EN) ; harness Ethernet.50, harness Ethernet.58, port RGMII.TX_EN, harness Ethernet2.1, harness Ethernet2.9
PHY_TXC: U19.E2(GTX_CLK) ; harness Ethernet.45, port RGMII.TXC
PHY_TXD0: U19.F1(TXD0) ; harness Ethernet.8, harness Ethernet.46, port RGMII.TXD0
PHY_TXD1: U19.G2(TXD1) ; harness Ethernet.9, harness Ethernet.47, port RGMII.TXD1
PHY_TXD2: U19.G3(TXD2) ; harness Ethernet.10, harness Ethernet.48, port RGMII.TXD2
PHY_TXD3: U19.H2(TXD3) ; harness Ethernet.11, harness Ethernet.49, port RGMII.TXD3
PHY_TXD4: U19.H1(TXD4) ; harness Ethernet.12
PHY_TXD5: U19.H3(TXD5) ; harness Ethernet.13
PHY_TXD6: U19.J1(TXD6) ; harness Ethernet.14
PHY_TXD7: U19.J2(TXD7) ; harness Ethernet.15
S_CLK_N: C87.1 ; harness Ethernet.25, harness Ethernet.65, port SGMII.S_OUT_N, harness Ethernet2.16
S_CLK_P: C86.1 ; harness Ethernet.24, harness Ethernet.64, port SGMII.S_OUT_P, harness Ethernet2.15
S_IN_N: C83.1 ; harness Ethernet.21, harness Ethernet.61, port SGMII.S_IN_N, harness Ethernet2.12
S_IN_P: C82.2 ; harness Ethernet.20, harness Ethernet.60, port SGMII.S_IN_P, harness Ethernet2.11
S_OUT_N: C85.1 ; harness Ethernet.23, harness Ethernet.63, port SGMII.S_CLK_N, harness Ethernet2.14
S_OUT_P: C84.1 ; harness Ethernet.22, harness Ethernet.62, port SGMII.S_CLK_P, harness Ethernet2.13
TST1: TP16.1(e1) U19.H8(SEL_FREQ) ; harness Ethernet2.78
TST2: TP17.1(e1) U19.L9(TCK) ; harness Ethernet2.79
TST3: TP18.1(e1) U19.L7(TDI) ; harness Ethernet2.47
TST4: TP19.1(e1) U19.K8(TDO) ; harness Ethernet2.48
TST5: TP20.1(e1) U19.L8(TMS) ; harness Ethernet2.49
TST7: R98.2 U19.M2(RSET) ; harness Ethernet2.77
xS_CLK_N: C87.2 U19.A6(S_CLK-) ; harness Ethernet.31
xS_CLK_P: C86.2 U19.A5(S_CLK+) ; harness Ethernet.30
xS_IN_N: C83.2 U19.A4(S_IN-) ; harness Ethernet.27
xS_IN_P: C82.1 U19.A3(S_IN+) ; harness Ethernet.26
xS_OUT_N: C85.2 U19.A8(S_OUT-) ; harness Ethernet.29
xS_OUT_P: C84.2 U19.A7(S_OUT+) ; harness Ethernet.28
NetC88_1: C88.1 R85.2 R86.2
NetC89_1: C89.1 R87.2 R88.2
NetC90_1: C90.1 R89.2 R90.2
NetC91_1: C91.1 R91.2 R92.2
NetC92_1: C92.1 X5.3
NetC93_1: C93.1 X5.6
NetC94_1: C94.1 C95.1 C96.1 L5.2 U19.B7(AVDD) U19.M3(AVDD) U19.M4(AVDD) U19.M7(AVDD) U19.M8(AVDD) U19.N5(AVDD)
NetC100_1: C100.1 Q2.3(OSC2) R93.1 U19.H9(XTAL1)
NetC101_1: C101.1 Q2.1(OSC1) R93.2 U19.J9(XTAL2)
NetHL1_2: HL1.2(Cathode) R79.2
NetHL2_2: HL2.2(Cathode) R82.2
NetHL3_2: HL3.2(Cathode) R83.2
NetHL4_2: HL4.2(Cathode) R84.2
NetR80_2: R80.2 X5.11
NetR81_2: R81.2 X5.10

Not connected (* = marked no-connect by the designer): U19 D2(RX_ER) G1(NC) K7(NC) M5(HSDAC+) M6(HSDAC-)

### Layout directives
net class Ethernet: (no net found under the mark)
differential pair: S_CLK_N, S_CLK_P, S_IN_N, S_IN_P, S_OUT_N, S_OUT_P
net class Ethernet2: (no net found under the mark)

### Notes on the sheet
- Предполагается работа в SGMII mode
- HWCFG MODE[3:0] = 0100
  SGMII without Clock with SGMII Auto-Neg to copper
- ANEG[3:0] = 1110
  Auto-Neg, advertise all capabilities, prefer Master
- PHYADR[4:0] = 00111
  PHY Address in MDC/MDIO mode
- Перепроверить конфигурацию !!
- Потребление
  +2.5V  - 0.25A  0.65W
  +1.0V  - 0.25A  0.25W
- Лист
- /
- Изм.
- № докум.
- Подп.
- Дата.
- (in symbol KLS12-TL051, part A) ETH; 10/100; 1nF 2KV

### Library data of the parts
C82-C95 C97 C98 = Cap: Конденсатор керамический; Voltage: 25V; PackageReference: 0402; ClassName: Ethernet
C96 C99 = Cap: C0805C476M9PAC; PackageReference: 0805; ClassName: Xilinx PWR
C100 C101 = Cap: Конденсатор керамический; PackageReference: 0402; ClassName: Ethernet
HL1-HL4 = ledG_KP-1608MGC_KP-1608: 1.6X0.8mm SMD  LED; LxWxH(mm): 1,6x0,8x1,1; Value: KP-1608MGC; PackageReference: 0603; Package: KP-1608_16x08x11; ClassName: Ethernet
L5 = BEAD_FERRITE_SM: Wurth Elektronik EMI FILTERS FERRITE BEAD, 220R@100MHz, 0.35R; PackageReference: 0402; Value: 742792780; ClassName: Ethernet
Q2 = XTAL: Chengdu Kingbri Frequency Technology Co., Ltd 25MHz; Value: 01XMD118JVF0025000000; PackageReference: SMD 3.2x2.5мм; ClassName: Ethernet
R79-R84 = Res2: Резистор; Precision: 1%; PackageReference: 0402; ClassName: Ethernet
R85-R98 = Res2: Резистор; PackageReference: 0402; ClassName: Ethernet
TP12-TP16 = Test_Point: Тестовая точка на плате; ClassName: Ethernet
TP17 = Test_Point: Тестовая точка на плате; MarkPCB: TCK; ClassName: Ethernet
TP18 = Test_Point: Тестовая точка на плате; MarkPCB: TDI; ClassName: Ethernet
TP19 = Test_Point: Тестовая точка на плате; MarkPCB: TDO; ClassName: Ethernet
TP20 = Test_Point: Тестовая точка на плате; MarkPCB: TMS; ClassName: Ethernet
U19 = 88E1111-B2-BAB1C000: Integrated 10/100/1000 Ultra Gigabit Ethernet Transceiver; Value: 88E1111-B2-BAB1C000; PackageReference: QFN96; ClassName: Ethernet
X5 = KLS12-TL051: 10/100 RJ45 с трансформаторами и двумя светодиодами; Value: KLS12-TL051

## Sheet Camera.SchDoc
size A3; Author: Швецов С.В.; Organization: PapuaSoft; SheetNumber: 7; SheetTotal: 8
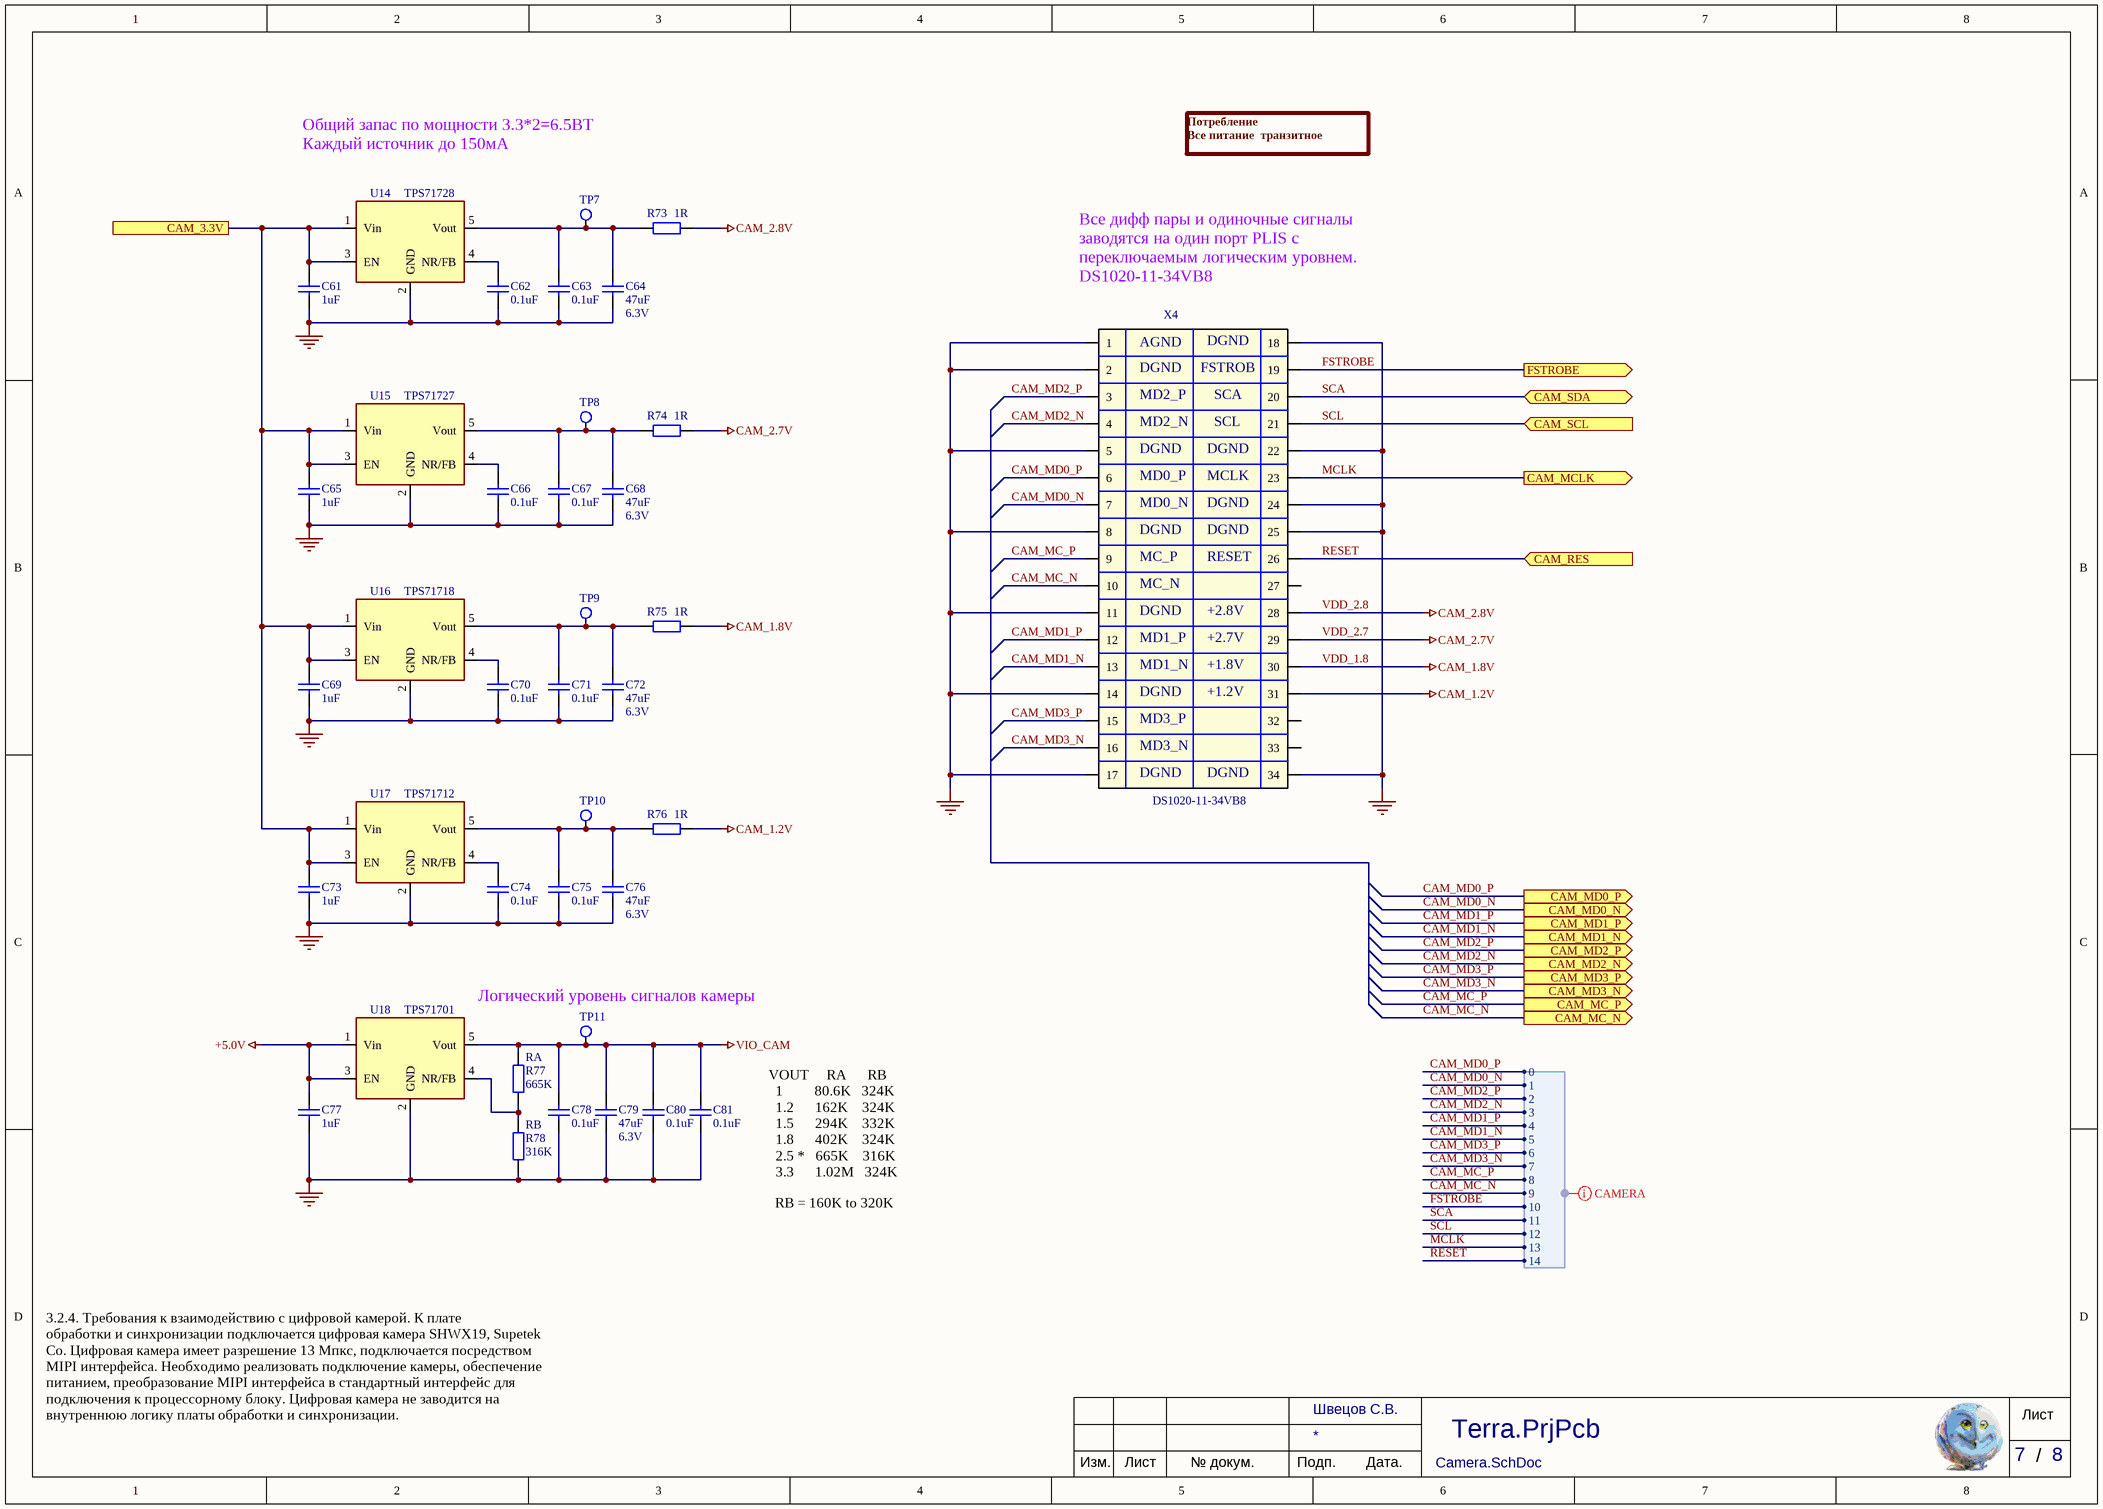
[diagram p10: Camera.SchDoc]

### Parts
C61  value 1uF  [C0603]  (hidden comment: Cap)
C62  value 0.1uF  [C0402]  (hidden comment: Cap)
C63  value 0.1uF  [C0402]  (hidden comment: Cap)
C64  value 47uF  Voltage: 6.3V  [C0805]  (hidden comment: Cap)
C65  value 1uF  [C0603]  (hidden comment: Cap)
C66  value 0.1uF  [C0402]  (hidden comment: Cap)
C67  value 0.1uF  [C0402]  (hidden comment: Cap)
C68  value 47uF  Voltage: 6.3V  [C0805]  (hidden comment: Cap)
C69  value 1uF  [C0603]  (hidden comment: Cap)
C70  value 0.1uF  [C0402]  (hidden comment: Cap)
C71  value 0.1uF  [C0402]  (hidden comment: Cap)
C72  value 47uF  Voltage: 6.3V  [C0805]  (hidden comment: Cap)
C73  value 1uF  [C0603]  (hidden comment: Cap)
C74  value 0.1uF  [C0402]  (hidden comment: Cap)
C75  value 0.1uF  [C0402]  (hidden comment: Cap)
C76  value 47uF  Voltage: 6.3V  [C0805]  (hidden comment: Cap)
C77  value 1uF  [C0603]  (hidden comment: Cap)
C78  value 0.1uF  [C0402]  (hidden comment: Cap)
C79  value 47uF  Voltage: 6.3V  [C0805]  (hidden comment: Cap)
C80  value 0.1uF  [C0402]  (hidden comment: Cap)
C81  value 0.1uF  [C0402]  (hidden comment: Cap)
R73  value 1R  [R0402]  (hidden comment: Res2)
R74  value 1R  [R0402]  (hidden comment: Res2)
R75  value 1R  [R0402]  (hidden comment: Res2)
R76  value 1R  [R0402]  (hidden comment: Res2)
R77  value 665K  Parameter 1: RA  [R0402]  (hidden comment: Res2)
R78  value 316K  Parameter 1: RB  [R0402]  (hidden comment: Res2)
TP7  (no value)  [TP_0MM5_1MM0]  (no BOM)
TP8  (no value)  [TP_0MM5_1MM0]  (no BOM)
TP9  (no value)  [TP_0MM5_1MM0]  (no BOM)
TP10  (no value)  [TP_0MM5_1MM0]  (no BOM)
TP11  (no value)  [TP_0MM5_1MM0]  (no BOM)
U14  value TPS71728  [SOT23_5]
U15  value TPS71727  [SOT23_5]
U16  value TPS71718  [SOT23_5]
U17  value TPS71712  [SOT23_5]
U18  value TPS71701  [SOT23_5]
X4  DS1020-11-34VB8  [DS1020-11-34VB8]

### Ports
CAM_3.3V, CAM_MC_N (out), CAM_MC_P (out), CAM_MCLK (out), CAM_MD0_N (out), CAM_MD0_P (out), CAM_MD1_N (out), CAM_MD1_P (out), CAM_MD2_N (out), CAM_MD2_P (out), CAM_MD3_N (out), CAM_MD3_P (out), CAM_RES (in), CAM_SCL (in), CAM_SDA (bidir), FSTROBE (out)

### Harnesses
CAMERA: 0, 1, 2, 3, 4, 5, 6, 7, 8, 9, 11, 12, 10, 13, 14

### Nets
+5.0V: C77.1 U18.1(Vin) U18.3(EN)
CAM_1.2V: R76.1 X4.31
GND: C61.2 C62.2 C63.2 C64.2 C65.2 C66.2 C67.2 C68.2 C69.2 C70.2 C71.2 C72.2 C73.2 C74.2 C75.2 C76.2 C77.2 C78.2 C79.2 C80.2 C81.2 R78.2 U14.2(GND) U15.2(GND) U16.2(GND) U17.2(GND) U18.2(GND) X4.1 X4.2 X4.5 X4.8 X4.11 X4.14 X4.17 X4.18 X4.22 X4.24 X4.25 X4.34  [project net +12V_INPUT]
VDD_1.8: R75.1 X4.30  [also labelled CAM_1.8V]
VDD_2.7: R74.1 X4.29  [also labelled CAM_2.7V]
VDD_2.8: R73.1 X4.28  [also labelled CAM_2.8V]
VIO_CAM: C78.1 C79.1 C80.1 C81.1 R77.1 TP11.1(e1) U18.5(Vout)
CAM_MC_N: X4.10 ; port CAM_MC_N, harness CAMERA.9
CAM_MC_P: X4.9 ; port CAM_MC_P, harness CAMERA.8
CAM_MD0_N: X4.7 ; port CAM_MD0_N, harness CAMERA.1
CAM_MD0_P: X4.6 ; port CAM_MD0_P, harness CAMERA.0
CAM_MD1_N: X4.13 ; port CAM_MD1_N, harness CAMERA.5
CAM_MD1_P: X4.12 ; port CAM_MD1_P, harness CAMERA.4
CAM_MD2_N: X4.4 ; port CAM_MD2_N, harness CAMERA.3
CAM_MD2_P: X4.3 ; port CAM_MD2_P, harness CAMERA.2
CAM_MD3_N: X4.16 ; port CAM_MD3_N, harness CAMERA.7
CAM_MD3_P: X4.15 ; port CAM_MD3_P, harness CAMERA.6
FSTROBE: X4.19 ; port FSTROBE, harness CAMERA.10
MCLK: X4.23 ; port CAM_MCLK, harness CAMERA.13  [project net CAM_MCLK]
RESET: X4.26 ; port CAM_RES, harness CAMERA.14  [project net CAM_RES]
SCA: X4.20 ; port CAM_SDA, harness CAMERA.11
SCL: X4.21 ; port CAM_SCL, harness CAMERA.12
NetC61_1: C61.1 C65.1 C69.1 C73.1 U14.1(Vin) U14.3(EN) U15.1(Vin) U15.3(EN) U16.1(Vin) U16.3(EN) U17.1(Vin) U17.3(EN) ; port CAM_3.3V
NetC62_1: C62.1 U14.4(NR/FB)
NetC63_1: C63.1 C64.1 R73.2 TP7.1(e1) U14.5(Vout)
NetC66_1: C66.1 U15.4(NR/FB)
NetC67_1: C67.1 C68.1 R74.2 TP8.1(e1) U15.5(Vout)
NetC70_1: C70.1 U16.4(NR/FB)
NetC71_1: C71.1 C72.1 R75.2 TP9.1(e1) U16.5(Vout)
NetC74_1: C74.1 U17.4(NR/FB)
NetC75_1: C75.1 C76.1 R76.2 TP10.1(e1) U17.5(Vout)
NetR77_2: R77.2 R78.1 U18.4(NR/FB)

Not connected (* = marked no-connect by the designer): X4 27 32 33

### Layout directives
net class CAMERA: (no net found under the mark)

### Notes on the sheet
- Общий запас по мощности 3.3*2=6.5ВТ
  Каждый источник до 150мА
- Потребление
  Все питание  транзитное
- (near X4) Все дифф пары и одиночные сигналы заводятся на один порт PLIS с переключаемым логическим уровнем.
  DS1020-11-34VB8
- (near X4) AGND
- (near X4) DGND
- (near X4) FSTROB
- (near X4) MD2_P
- (near X4) MD2_N
- (near X4) SCA
- (near X4) SCL
- (near X4) MD0_P
- (near X4) MD0_N
- (near X4) MCLK
- (near X4) MC_P
- (near X4) MC_N
- (near X4) RESET
- (near X4) MD1_P
- (near X4) +2.7V
- (near X4) +2.8V
- (near X4) MD1_N
- (near X4) MD3_P
- (near X4) +1.8V
- (near X4) +1.2V
- (near X4) MD3_N
- (near TP11) Логический уровень сигналов камеры
- VOUT     RA      RB
  1         80.6K   324K
  1.2      162K    324K
  1.5      294K    332K
  1.8      402K    324K
  2.5 *   665K    316K
  3.3      1.02M   324K
- RB = 160K to 320K
- 3.2.4. Требования к взаимодействию с цифровой камерой. К плате
  обработки и синхронизации подключается цифровая камера SHWX19, Supetek
  Co. Цифровая камера имеет разрешение 13 Мпкс, подключается посредством
  MIPI интерфейса. Необходимо реализовать подключение камеры, обеспечение
  питанием, преобразование MIPI интерфейса в стандартный интерфейс для
  подключения к процессорному блоку. Цифровая камера не заводится на
  внутреннюю логику платы обработки и синхронизации.
- Лист
- /
- Изм.
- № докум.
- Подп.
- Дата.

### Library data of the parts
C61 C65 C69 C73 C77 = Cap: Конденсатор керамический; PackageReference: 0603; ClassName: CAM_POWER
C62 C63 C66 C67 C70 C71 C74 C75 C78 C80 C81 = Cap: Конденсатор керамический; Voltage: 25V; PackageReference: 0402; ClassName: CAM_POWER
C64 C68 C72 C76 C79 = Cap: C0805C476M9PAC; PackageReference: 0805; ClassName: CAM_POWER
R73-R78 = Res2: Резистор; PackageReference: 0402; ClassName: CAM_POWER
TP7 = Test_Point: Тестовая точка на плате; MarkPCB: +2.8V; ClassName: CAM_POWER
TP8 = Test_Point: Тестовая точка на плате; MarkPCB: +2.7V; ClassName: CAM_POWER
TP9 = Test_Point: Тестовая точка на плате; MarkPCB: +1.8V; ClassName: CAM_POWER
TP10 TP11 = Test_Point: Тестовая точка на плате; MarkPCB: +1.2V; ClassName: CAM_POWER
U14 = TPS71701: Линейный стабилизатор +2.8В; PackageReference: SC70-5; ClassName: CAM_POWER; Parameter 1: *
U15 = TPS71701: Линейный стабилизатор +2.7В; PackageReference: SC70-5; ClassName: CAM_POWER; Parameter 1: *
U16 = TPS71701: Линейный стабилизатор +1.8В; PackageReference: SC70-5; ClassName: CAM_POWER; Parameter 1: *
U17 U18 = TPS71701: Линейный стабилизатор +1.2В; PackageReference: SC70-5; ClassName: CAM_POWER; Parameter 1: *
X4 = CON2x16: Розетка  Kyocera; Value: DS1020-11-34VB8; ClassName: *

## Nets that join several sheets
+1.0V: Xilinx_pwr (32 pins), Power (6 pins), Ethernet (11 pins)
+1.2V: Xilinx_pwr (9 pins), Power (C154.1 C155.1 TP34.1 U39.5)
+1.5V: Xilinx_main (14 pins), Xilinx_DDR (5 pins), Xilinx_pwr (64 pins), Power (7 pins)
+1.8V: Xilinx_pwr (7 pins), Power (7 pins)
+2.5V: Xilinx_main (JP1.1), Xilinx_pwr (23 pins), ADC (13 pins), Power (7 pins), Ethernet (20 pins)
+3.3V: Xilinx_main (JP1.3 U23.8 U24.8 U29.1), USB_CAN (10 pins), BiSS (8 pins), UART_USB (HL5.1 HL6.1 R119.2 U30.1), Xilinx_DDR (9 pins), Xilinx_pwr (28 pins), Power (7 pins)
+5.0V: USB_CAN (C54.1 C55.1 U9.3), ADC (C31.1 U5.3 U5.4), Power (8 pins), Camera (C77.1 U18.1 U18.3)
+12V_INPUT: Terra_main (38 pins), Xilinx_main (17 pins), USB_CAN (22 pins), BiSS (12 pins), UART_USB (18 pins), Xilinx_DDR (23 pins), Xilinx_pwr (208 pins), ADC (54 pins), Power (99 pins), Ethernet (46 pins), Camera (39 pins)
VIO_CAM: Xilinx_main (R106.2 R107.2 R108.2), Xilinx_pwr (6 pins), Camera (7 pins)
ADC0_CLK_N: Xilinx_main (U20.W11), ADC (U1.35)
ADC0_CLK_P: Xilinx_main (U20.W12), ADC (U1.34)
ADC0_CSn: Xilinx_main (U20.Y14), ADC (U1.48)
ADC0_D0: Xilinx_main (U20.W15), ADC (R3.2)
ADC0_D1: Xilinx_main (U20.V14), ADC (R4.2)
ADC0_D2: Xilinx_main (U20.U15), ADC (R5.2)
ADC0_D3: Xilinx_main (U20.T15), ADC (R6.2)
ADC0_D4: Xilinx_main (U20.U16), ADC (R9.2)
ADC0_D5: Xilinx_main (U20.T16), ADC (R11.2)
ADC0_D6: Xilinx_main (U20.N18), ADC (R13.2)
ADC0_D7: Xilinx_main (U20.N19), ADC (R15.2)
ADC0_D8: Xilinx_main (U20.V15), ADC (R16.2)
ADC0_D9: Xilinx_main (U20.M22), ADC (R17.2)
ADC0_D10: Xilinx_main (U20.N20), ADC (R18.2)
ADC0_D11: Xilinx_main (U20.K18), ADC (R23.2)
ADC0_D12: Xilinx_main (U20.M18), ADC (R24.2)
ADC0_D13: Xilinx_main (U20.W16), ADC (R25.2)
ADC0_D14: Xilinx_main (U20.AB17), ADC (R26.2)
ADC0_D15: Xilinx_main (U20.Y17), ADC (R28.2)
ADC0_DCO: Xilinx_main (U20.W14), ADC (R30.2)
ADC0_OR: Xilinx_main (U20.M16), ADC (R29.2)
ADC1_CLK_N: Xilinx_main (U20.W10), ADC (U3.35)
ADC1_CLK_P: Xilinx_main (U20.V10), ADC (U3.34)
ADC1_CSn: Xilinx_main (U20.Y12), ADC (U3.48)
ADC1_D0: Xilinx_main (U20.AA16), ADC (R33.2)
ADC1_D1: Xilinx_main (U20.AB15), ADC (R34.2)
ADC1_D2: Xilinx_main (U20.AA15), ADC (R35.2)
ADC1_D3: Xilinx_main (U20.AA14), ADC (R36.2)
ADC1_D4: Xilinx_main (U20.V13), ADC (R39.2)
ADC1_D5: Xilinx_main (U20.AB13), ADC (R41.2)
ADC1_D6: Xilinx_main (U20.AA13), ADC (R43.2)
ADC1_D7: Xilinx_main (U20.Y13), ADC (R45.2)
ADC1_D8: Xilinx_main (U20.AB12), ADC (R46.2)
ADC1_D9: Xilinx_main (U20.Y11), ADC (R47.2)
ADC1_D10: Xilinx_main (U20.AB11), ADC (R48.2)
ADC1_D11: Xilinx_main (U20.AA11), ADC (R53.2)
ADC1_D12: Xilinx_main (U20.AB10), ADC (R54.2)
ADC1_D13: Xilinx_main (U20.AA10), ADC (R55.2)
ADC1_D14: Xilinx_main (U20.K14), ADC (R56.2)
ADC1_D15: Xilinx_main (U20.K13), ADC (R58.2)
ADC1_DCO: Xilinx_main (U20.AB16), ADC (R60.2)
ADC1_OR: Xilinx_main (U20.AA9), ADC (R59.2)
ADC_HV_EN: Terra_main (X1.15), Xilinx_main (U22.3)
ADC_INT: Terra_main (X1.7), Xilinx_main (U21.6)
ADC_LDAC: Terra_main (X1.13), Xilinx_main (U22.2)
ADC_PWR: Xilinx_main (U20.Y16), ADC (U1.25 U3.25)
ADC_RESn: Xilinx_main (U20.T14), ADC (U1.45 U3.45)
ADC_SDIO: Xilinx_main (U20.M15), ADC (U1.46 U3.46)
BiSS0_ZPNT: Terra_main (X2.26), Xilinx_main (U21.7)
CAM_EN: Xilinx_main (U20.G20), Power (VD1.2)
CAM_MC_N: Xilinx_main (U20.D22), Camera (X4.10)
CAM_MC_P: Xilinx_main (U20.E22), Camera (X4.9)
CAM_MCLK: Xilinx_main (U20.A20), Camera (X4.23)
CAM_MD0_N: Xilinx_main (U20.B22), Camera (X4.7)
CAM_MD0_P: Xilinx_main (U20.C22), Camera (X4.6)
CAM_MD1_N: Xilinx_main (U20.A14), Camera (X4.13)
CAM_MD1_P: Xilinx_main (U20.A13), Camera (X4.12)
CAM_MD2_N: Xilinx_main (U20.A19), Camera (X4.4)
CAM_MD2_P: Xilinx_main (U20.A18), Camera (X4.3)
CAM_MD3_N: Xilinx_main (U20.A16), Camera (X4.16)
CAM_MD3_P: Xilinx_main (U20.A15), Camera (X4.15)
CAM_RES: Xilinx_main (U20.B21), Camera (X4.26)
ENET_INTn: Xilinx_main (U20.N22), Ethernet (R96.2 U19.L1)
ENET_MDC: Xilinx_main (U20.G16), Ethernet (R95.2 U19.L3)
ENET_MDIO: Xilinx_main (U20.M21), Ethernet (R94.2 U19.M1)
ENET_RESETn: Xilinx_main (U20.J22), Ethernet (U19.K3)
FSTROBE: Xilinx_main (U20.A21), Camera (X4.19)
LASER_LVDS_N: Terra_main (X3.16), Xilinx_main (U29.7)
LASER_LVDS_P: Terra_main (X3.18), Xilinx_main (U29.8)
LS_DISABLE: Terra_main (X3.12), Xilinx_main (U23.2)
LS_EN_POW: Terra_main (X3.5), Xilinx_main (U24.3)
LS_SHDN: Terra_main (X3.10), Xilinx_main (U23.3)
MA1+: Terra_main (X2.18), BiSS (R70.1 U11.8)
MA1-: Terra_main (X2.19), BiSS (R70.2 U11.7)
MA2+: Terra_main (X2.24), BiSS (R72.1 U13.8)
MA2-: Terra_main (X2.25), BiSS (R72.2 U13.7)
NetC6_2: Terra_main (X1.2), ADC (C6.2 R7.2)
NetC9_2: Terra_main (X1.4), ADC (C9.2 R7.1)
NetC21_2: Terra_main (X1.1), ADC (C21.2 R37.2)
NetC24_2: Terra_main (X1.3), ADC (C24.2 R37.1)
NetC61_1: Power (8 pins), Camera (12 pins)
NetR62_1: Terra_main (X2.9), USB_CAN (R62.1 U8.2)
NetR63_1: Terra_main (X2.7), USB_CAN (R63.1 U8.1)
NetR66_2: Terra_main (X2.8), USB_CAN (R66.2 U9.7)
NetR67_1: Terra_main (X2.10), USB_CAN (R67.1 U9.6)
NetR102_1: Terra_main (X1.9), Xilinx_main (R102.1 U25.6)
NetR103_1: Terra_main (X1.11), Xilinx_main (R103.1 U25.5)
NetR112_1: Terra_main (X3.7), Xilinx_main (R112.1 U27.6)
NetR113_1: Terra_main (X3.9), Xilinx_main (R113.1 U27.5)
NetR117_1: Terra_main (X2.11), Xilinx_main (R117.1 U28.6)
NetR118_1: Terra_main (X2.13), Xilinx_main (R118.1 U28.5)
PHY_125MHZ: Xilinx_main (U20.G18 U20.K19), Ethernet (U19.B6 U19.K2)
PHY_CRS: Xilinx_main (U20.H19), Ethernet (U19.B5)
PHY_RX_DV: Xilinx_main (U20.J20), Ethernet (U19.B1)
PHY_RX_ERR: Xilinx_main (U20.G17), Ethernet (U19.F2)
PHY_RXC: Xilinx_main (U20.K22), Ethernet (U19.C1)
PHY_RXD0: Xilinx_main (U20.J21), Ethernet (U19.B2)
PHY_RXD1: Xilinx_main (U20.H20), Ethernet (U19.D3)
PHY_RXD2: Xilinx_main (U20.H17), Ethernet (U19.C3)
PHY_RXD3: Xilinx_main (U20.L16), Ethernet (U19.B3)
PHY_TRSTn: Xilinx_main (U20.L20), Ethernet (U19.M9)
PHY_TX_EN: Xilinx_main (U20.J19), Ethernet (U19.E1)
PHY_TXC: Xilinx_main (U20.H22), Ethernet (U19.E2)
PHY_TXD0: Xilinx_main (U20.L14), Ethernet (U19.F1)
PHY_TXD1: Xilinx_main (U20.L18), Ethernet (U19.G2)
PHY_TXD2: Xilinx_main (U20.K21), Ethernet (U19.G3)
PHY_TXD3: Xilinx_main (U20.L21), Ethernet (U19.H2)
S_CLK_N: Xilinx_main (U20.H15), Ethernet (C87.1)
S_CLK_P: Xilinx_main (U20.J15), Ethernet (C86.1)
S_IN_N: Xilinx_main (U20.J17), Ethernet (C83.1)
S_IN_P: Xilinx_main (U20.K17), Ethernet (C82.2)
S_OUT_N: Xilinx_main (U20.H14), Ethernet (C85.1)
S_OUT_P: Xilinx_main (U20.J14), Ethernet (C84.1)
SCA: Xilinx_main (R108.1 U26.5), Camera (X4.20)
SCL: Xilinx_main (R107.1 U26.6), Camera (X4.21)
SLO1+: Terra_main (X2.16), BiSS (R69.1 U10.8)
SLO1-: Terra_main (X2.17), BiSS (R69.2 U10.7)
SLO2+: Terra_main (X2.22), BiSS (R71.1 U12.8)
SLO2-: Terra_main (X2.23), BiSS (R71.2 U12.7)
USB_DATA0: Xilinx_main (U20.AB21), USB_CAN (U7.24)
USB_DATA1: Xilinx_main (U20.AB22), USB_CAN (U7.23)
USB_DATA2: Xilinx_main (U20.AA21), USB_CAN (U7.22)
USB_DATA3: Xilinx_main (U20.Y22), USB_CAN (U7.21)
USB_DATA4: Xilinx_main (U20.Y21), USB_CAN (U7.20)
USB_DATA5: Xilinx_main (U20.W22), USB_CAN (U7.19)
USB_DATA6: Xilinx_main (U20.W21), USB_CAN (U7.18)
USB_DATA7: Xilinx_main (U20.V22), USB_CAN (U7.17)
xADC_HV_EN: Xilinx_main (U22.6), Xilinx_DDR (U20.W5)
xADC_INT: Xilinx_main (U21.3), Xilinx_DDR (U20.W6)
xADC_LDAC: Xilinx_main (U22.7), Xilinx_DDR (U20.V3)
xADC_SCL: Xilinx_main (R99.1 U25.3), Xilinx_DDR (U20.Y8)
xADC_SDA: Xilinx_main (R100.1 U25.4), Xilinx_DDR (U20.Y7)
xBiSS0_ZPNT: Xilinx_main (U21.2), Xilinx_DDR (U20.U6)
xBiSS1_CLK: Xilinx_main (R114.1 U20.P15 U28.3), BiSS (U11.2), Xilinx_DDR (U20.AA8)
xBiSS1_DATA: Xilinx_main (U20.N17), BiSS (U10.2)
xBiSS2_CLK: Xilinx_main (U20.N14), BiSS (U13.2)
xBiSS2_DATA: Xilinx_main (U20.N15), BiSS (U12.2)
xCAM_SCL: Xilinx_main (R104.1 U26.3), Xilinx_DDR (U20.Y9)
xCAM_SDA: Xilinx_main (R105.1 U26.4), Xilinx_DDR (U20.AB8)
xCAN_RX: Xilinx_main (U20.T19), USB_CAN (U9.4)
xCAN_STB: Xilinx_main (U20.P17), USB_CAN (R68.1 U9.8)
xCAN_TX: Xilinx_main (U20.T20), USB_CAN (U9.1)
xEXT_SDA: Xilinx_main (R115.1 U28.4), Xilinx_DDR (U20.W9)
xLS_SCL: Xilinx_main (R109.1 U27.3), Xilinx_DDR (U20.V8)
xLS_SDA: Xilinx_main (R110.1 U27.4), Xilinx_DDR (U20.W7)
xUSB_24MHZ: Xilinx_main (U20.W20), USB_CAN (C51.1)
xUSB_DIR: Xilinx_main (U20.R21), USB_CAN (U7.12)
xUSB_NXP: Xilinx_main (U20.R22), USB_CAN (U7.11)
xUSB_RES: Xilinx_main (U20.P20), USB_CAN (U7.9)
xUSB_SCK: Xilinx_main (U20.U21), USB_CAN (U7.14)
xUSB_STP: Xilinx_main (U20.U22), USB_CAN (U7.13)
xUSB_UART_RX: Xilinx_main (U20.AA19), UART_USB (TP22.1 U30.30)
xUSB_UART_TX: Xilinx_main (U20.AA20), UART_USB (TP23.1 U30.2)